# EAGLE design Controller (EAGLE 7.2.0)
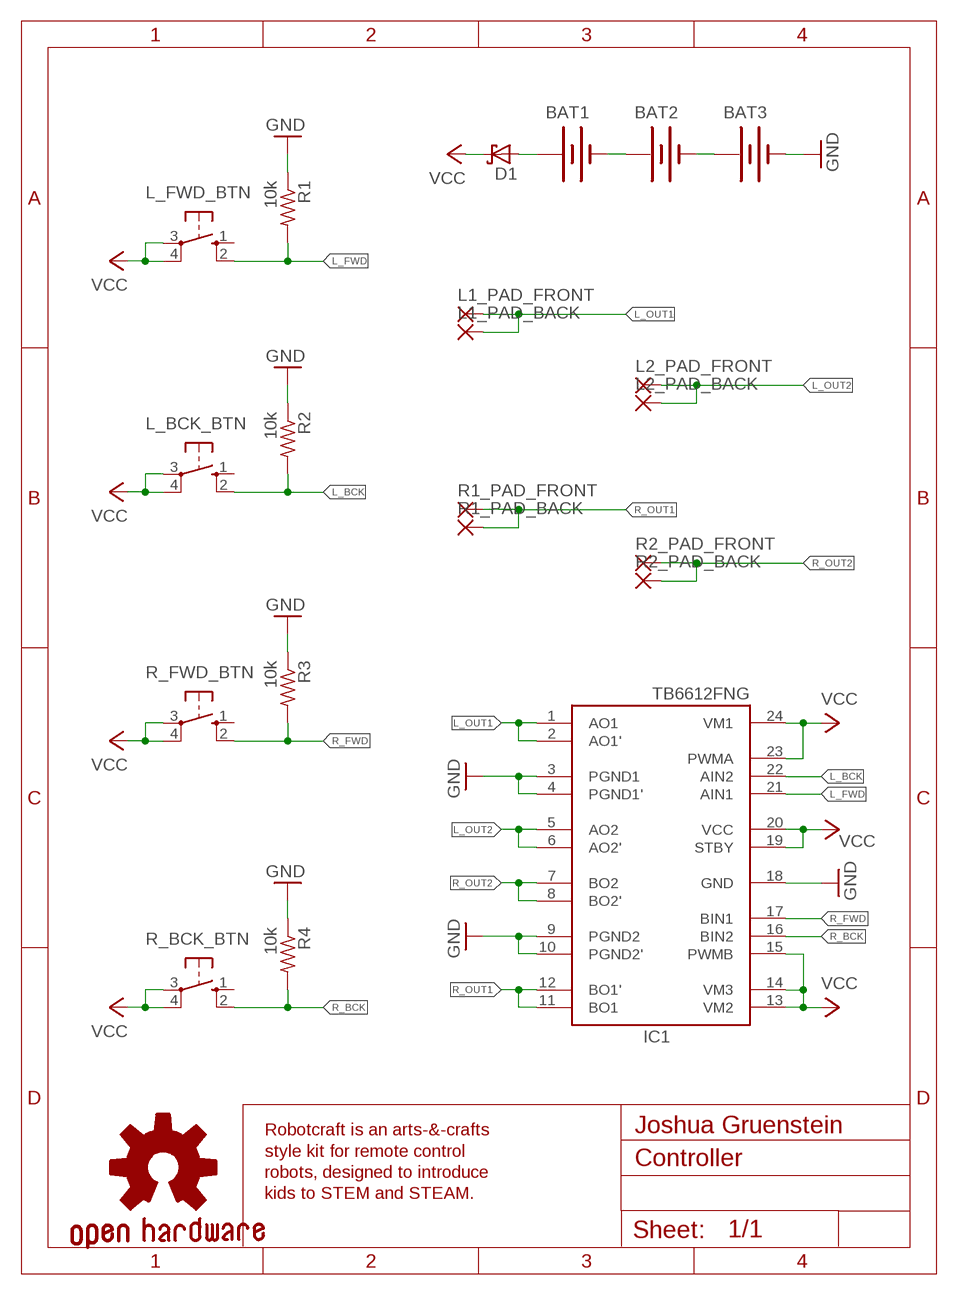
[diagram p0: schematic, sheet 1]

## Parts
BAT1  BATTERYAA-KIT  [BATTERY-AA-KIT]
BAT2  BATTERYAA-KIT  [BATTERY-AA-KIT]
BAT3  BATTERYAA-KIT  [BATTERY-AA-KIT]
D1  SCHOTTKY-DIODESMC  [SMC]
GOLD_ORB_SM1  OSHWLOGO_GOLD_ORB_MED  [OSHW1]
IC1  TB6612FNG  [SSOP24]
L1_PAD_BACK  WIREPADSMD5-2,5  [5-2,5]
L1_PAD_FRONT  WIREPADSMD5-2,5  [5-2,5]
L2_PAD_BACK  WIREPADSMD5-2,5  [5-2,5]
L2_PAD_FRONT  WIREPADSMD5-2,5  [5-2,5]
L_BCK_BTN  40-XX  [B3F-40XX]
L_FWD_BTN  40-XX  [B3F-40XX]
R1  10k  R-US_R0805  [R0805]
R1_PAD_BACK  WIREPADSMD5-2,5  [5-2,5]
R1_PAD_FRONT  WIREPADSMD5-2,5  [5-2,5]
R2  10k  R-US_R0805  [R0805]
R2_PAD_BACK  WIREPADSMD5-2,5  [5-2,5]
R2_PAD_FRONT  WIREPADSMD5-2,5  [5-2,5]
R3  10k  R-US_R0805  [R0805]
R4  10k  R-US_R0805  [R0805]
R_BCK_BTN  40-XX  [B3F-40XX]
R_FWD_BTN  40-XX  [B3F-40XX]

## Nets
GND: BAT3.GND@1(-) IC1.3(PGND1) IC1.4(PGND1') IC1.9(PGND2) IC1.10(PGND2') IC1.18(GND) R1.1 R2.1 R3.1 R4.1
L_BCK: IC1.22(AIN2) L_BCK_BTN.2(S1) R2.2
L_FWD: IC1.21(AIN1) L_FWD_BTN.2(S1) R1.2
L_OUT1: IC1.1(AO1) IC1.2(AO1') L1_PAD_BACK.1(P) L1_PAD_FRONT.1(P)
L_OUT2: IC1.5(AO2) IC1.6(AO2') L2_PAD_BACK.1(P) L2_PAD_FRONT.1(P)
N$1: BAT1.GND@1(-) BAT2.PWR@1(+)
N$2: BAT2.GND@1(-) BAT3.PWR@1(+)
N$3: BAT1.PWR@1(+) D1.A
R_BCK: IC1.16(BIN2) R4.2 R_BCK_BTN.2(S1)
R_FWD: IC1.17(BIN1) R3.2 R_FWD_BTN.2(S1)
R_OUT1: IC1.11(BO1) IC1.12(BO1') R1_PAD_BACK.1(P) R1_PAD_FRONT.1(P)
R_OUT2: IC1.7(BO2) IC1.8(BO2') R2_PAD_BACK.1(P) R2_PAD_FRONT.1(P)
VCC: D1.C IC1.13(VM2) IC1.14(VM3) IC1.15(PWMB) IC1.19(STBY) IC1.20(VCC) IC1.23(PWMA) IC1.24(VM1) L_BCK_BTN.3(P) L_BCK_BTN.4(P1) L_FWD_BTN.3(P) L_FWD_BTN.4(P1) R_BCK_BTN.3(P) R_BCK_BTN.4(P1) R_FWD_BTN.3(P) R_FWD_BTN.4(P1)
Unconnected: L_BCK_BTN.1(S) L_FWD_BTN.1(S) R_BCK_BTN.1(S) R_FWD_BTN.1(S)

## Notes on the sheet
- Joshua Gruenstein
- Robotcraft is an arts-&-crafts
  style kit for remote control
  robots, designed to introduce
  kids to STEM and STEAM.

## Library data of the parts
BAT1-BAT3 = SparkFun-Electromechanical:BATTERY: Battery Holders Various common sizes : AA, AAA, 18650 (PRT-12895), 20mm coin cell and 12mm coin cell. 20MM_4LEGS, BATT-10373; PROD_ID: BATT-08316
D1 = diode:SCHOTTKY-DIODE: Schottky Diode
GOLD_ORB_SM1 = bfl:OSHWLOGO: These are Open-Source Hardware logos.
IC1 = adafruit:TB6612FNG: TB6612FNG MOS dual H-bridge motor driver, 1.2A current 3.2A peak 3 or 5v logic and 3-15v motor
L1_PAD_BACK L1_PAD_FRONT L2_PAD_BACK L2_PAD_FRONT R1_PAD_BACK R1_PAD_FRONT R2_PAD_BACK R2_PAD_FRONT = wirepad:WIREPAD: Wire PAD connect wire on PCB
L_BCK_BTN L_FWD_BTN R_BCK_BTN R_FWD_BTN = switch-omron:40-XX: OMRON SWITCH; MF: OMRON COMPONENTS USA; MPN: B3F-4000; OC_FARNELL: 176434; OC_NEWARK: 36K3105
R1-R4 = rcl:R-US_: RESISTOR, American symbol

## Board
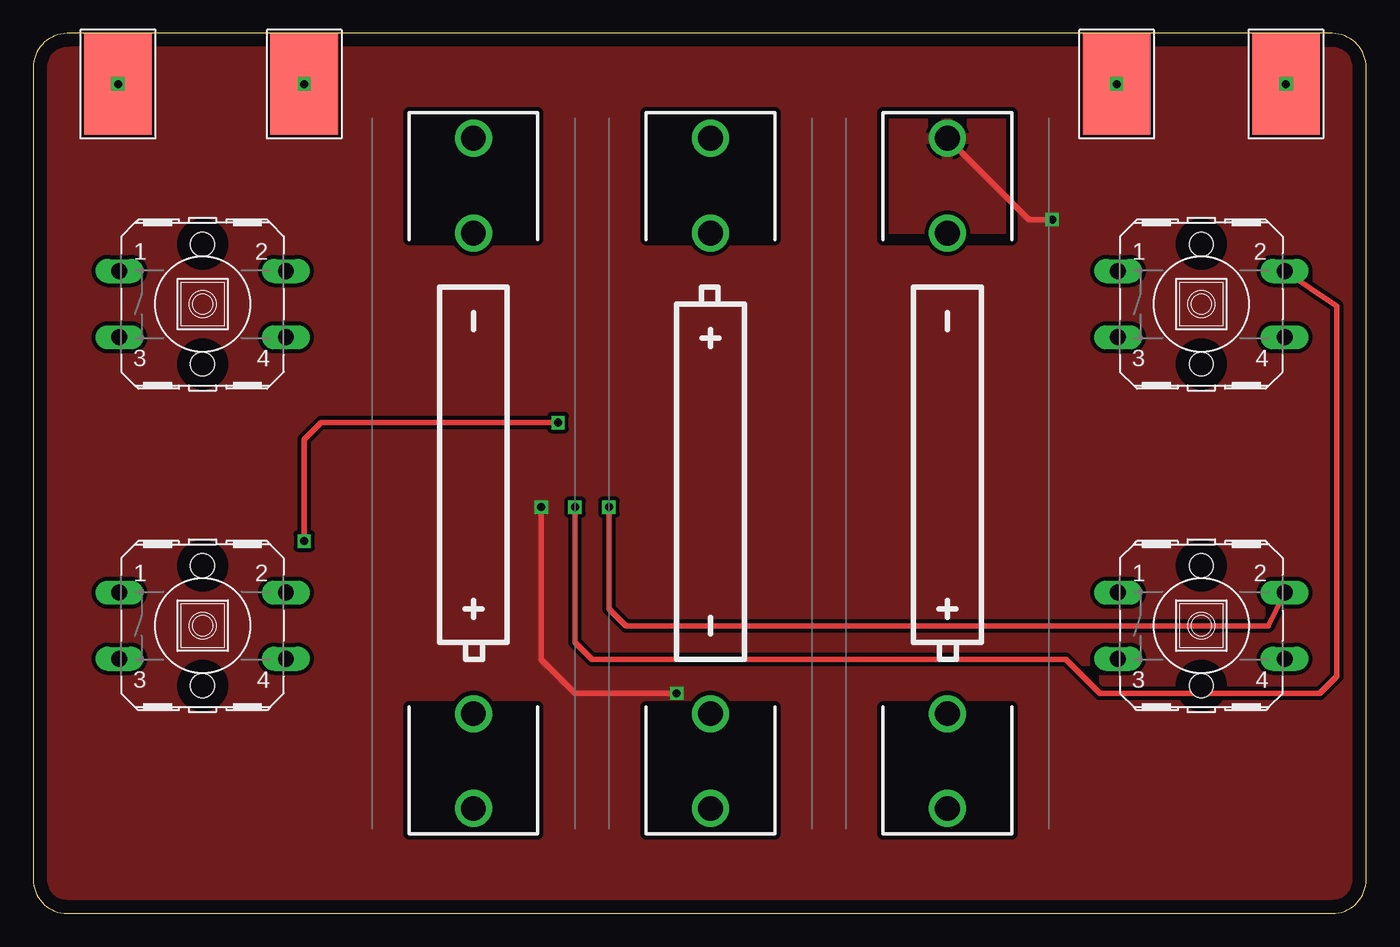
[diagram p1: board, top side]
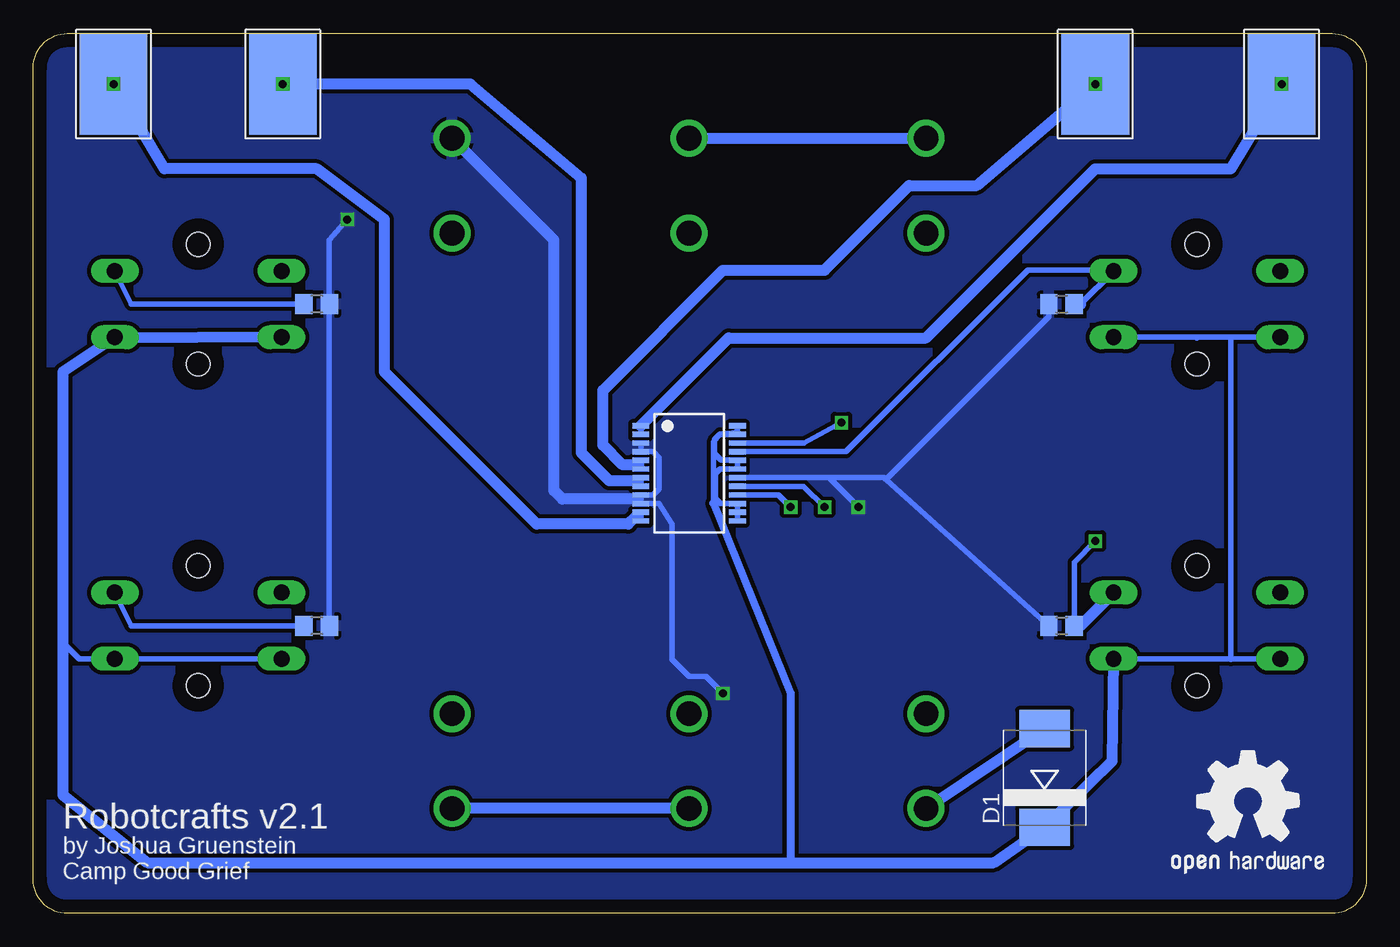
[diagram p2: board, bottom side, seen from below]

Size 100 x 66.03 mm. Coordinates in mm from the lower left corner, seen from the top.
Outline: 0,63.49 0,2.54 arc90 2.54,0 97.46,0 arc90 100,2.54 100,63.49 arc90 97.46,66.03 2.54,66.03 arc90 0,63.49
Copper layers (1*16): Top 0.035mm / dielectric 1.5mm / Bottom 0.035mm
Design rules "default": minimum track width 10mil, minimum drill 24mil, track to track 8mil, track to pad 8mil, pad to pad 8mil, via to via 8mil, smd to smd 8mil, copper to edge 40mil, drill to drill 8mil, minimum pad ring 10mil, minimum via ring 8mil, stop-mask expansion 4mil, vias tented up to drill 0mil, thermal gap 10mil

### Footprints (pad centres in the part's own frame; a part is rotated, then mirrored left to right if it is on the bottom)
BATTERY-AA-KIT = drill 1.854: GND@1 25.146,0; GND@2 18.034,0; PWR@1 -25.146,0; PWR@2 -18.034,0
SMC = smd 2.8 x 3.8: A 3.7,0; C -3.7,0
SSOP24 = smd 0.4 x 1.25: 1 -3.575,-3.625; 2 -2.925,-3.625; 3 -2.275,-3.625; 4 -1.625,-3.625; 5 -0.975,-3.625; 6 -0.325,-3.625; 7 0.325,-3.625; 8 0.975,-3.625; 9 1.625,-3.625; 10 2.275,-3.625; 11 2.925,-3.625; 12 3.575,-3.625; 13 3.575,3.625; 14 2.925,3.625; 15 2.275,3.625; 16 1.625,3.625; 17 0.975,3.625; 18 0.325,3.625; 19 -0.325,3.625; 20 -0.975,3.625; 21 -1.625,3.625; 22 -2.275,3.625; 23 -2.925,3.625; 24 -3.575,3.625
5-2,5 = smd 5.08 x 7.62: 1 1.27,-1.27
B3F-40XX = drill 1.194 long: 1 -6.248,2.489; 2 6.248,2.489; 3 -6.248,-2.489; 4 6.248,-2.489 | hole 1.803: 0,-4.496; 0,4.496
R0805 = smd 1.3 x 1.5: 1 -0.95,0; 2 0.95,0

### Placement (x,y rotation side)
BAT1  33.02,33.02 90 top
BAT2  50.8,33.02 270 top
BAT3  68.58,33.02 90 top
D1  24.13,10.16 90 bottom
GOLD_ORB_SM1  15.24,1.27 0 bottom
IC1  50.8,33.02 270 bottom
L1_PAD_BACK  7.62,63.5 0 bottom
L1_PAD_FRONT  5.08,63.5 0 top
L2_PAD_BACK  21.59,63.5 0 bottom
L2_PAD_FRONT  19.05,63.5 0 top
L_BCK_BTN  12.7,21.59 0 top
L_FWD_BTN  12.7,45.72 0 top
R1  22.86,45.72 0 bottom
R1_PAD_BACK  95.25,63.5 0 bottom
R1_PAD_FRONT  92.71,63.5 0 top
R2  22.86,21.59 0 bottom
R2_PAD_BACK  82.55,63.5 0 bottom
R2_PAD_FRONT  80.01,63.5 0 top
R3  78.74,45.72 180 bottom
R4  78.74,21.59 180 bottom
R_BCK_BTN  87.63,21.59 0 top
R_FWD_BTN  87.63,45.72 0 top

### Tracks (layer width: path | path; a pad name or v marks a point on that pad's centre or on a via)
GND  (via drill 0.6)
  Top 0.406: v38.1,30.48 38.1,19.05 40.64,16.51 v48.26,16.51 | BAT3.GND@1 74.68,52.07 v76.45,52.07
  Bottom 0.406: IC1.3 IC1.4 53.48,34.65 53.04,34.2 53.04,31.86 53.5,31.4 IC1.9 | IC1.9 IC1.10 53.08,30.75 52.07,29.21 52.07,19.05 50.8,17.78 49.53,17.78 v48.26,16.51 | R2.1 36.03,32.55 | 36.03,32.55 36.19,32.7 IC1.18 40.31,32.7 v38.1,30.48 | R1.1 23.81,44.77 36.03,32.55 | R4.1 R3.1 77.79,50.53 v76.45,52.07 | IC1.9 54.62,31.2 54.62,31.05
  Bottom 0.61: 60.96,31.75 60.94,31.73 60.6,31.39
  Bottom 0.813: BAT3.GND@1 60.96,50.55 60.96,31.75 | 54.62,31.05 54.66,31.09 60.3,31.09 60.94,31.73
  pour Top (isolate 0.305): -1.27,67.31 101.6,67.31 101.6,-1.27 -1.27,-1.27
  pour Bottom (isolate 0.305): 0,67.31 101.6,67.31 101.6,-1.27 -1.27,-1.27 -1.27,67.31
L_BCK  (via drill 0.6)
  Top 0.406: v20.32,27.94 20.32,35.56 21.59,36.83 v39.37,36.83
  Bottom 0.406: R2.2 21.91,26.35 v20.32,27.94 | v39.37,36.83 42.17,35.3 IC1.22
  Bottom 0.813: R2.2 21.44,21.59 L_BCK_BTN.2
L_FWD
  Bottom 0.406: IC1.21 39.02,34.65 25.4,48.26 19,48.26 L_FWD_BTN.2 21.44,45.72
  Bottom 0.813: 21.44,45.72 R1.2
L_OUT1  (via drill 0.6)
  Bottom 0.406: IC1.2 IC1.1
  Bottom 0.813: IC1.1 47.84,43.18 33.02,43.18 20.32,55.88 10.16,55.88 L1_PAD_BACK.1
  other vias: 6.35,62.23
L_OUT2  (via drill 0.6)
  Bottom 0.406: IC1.6 IC1.5 54.42,33.81 54.57,33.66
  Bottom 0.813: 54.57,33.66 55.79,33.66 57.27,35.14 57.27,39.25 48.26,48.26 40.64,48.26 34.29,54.61 29.21,54.61 L2_PAD_BACK.1
  other vias: 20.32,62.23
N$1
  Bottom 0.813: BAT2.PWR@1 BAT1.GND@1
N$2
  Bottom 0.813: BAT2.GND@1 BAT3.PWR@1
N$3
  Bottom 0.813: BAT1.PWR@1 D1.A
R_BCK  (via drill 0.6)
  Top 0.406: v43.18,30.48 43.18,22.86 44.45,21.59 92.66,21.59 R_BCK_BTN.2
  Bottom 0.406: IC1.16 44.09,31.39 v43.18,30.48 | R4.2 92.66,21.59 R_BCK_BTN.2
R_FWD  (via drill 0.6)
  Top 0.406: v40.64,30.48 40.64,20.32 41.91,19.05 77.47,19.05 80.01,16.51 96.52,16.51 97.79,17.78 97.79,45.57 R_FWD_BTN.2
  Bottom 0.406: IC1.17 42.2,32.05 v40.64,30.48 | R_FWD_BTN.2 92.66,45.72 R3.2
R_OUT1  (via drill 0.6)
  Bottom 0.406: IC1.12 IC1.11 54.76,29.76 54.81,29.76
  Bottom 0.813: 54.81,29.76 55.36,29.21 62.23,29.21 73.66,40.64 73.66,52.07 78.74,55.88 90.17,55.88 R1_PAD_FRONT.1
  other vias: 93.98,62.23
R_OUT2  (via drill 0.6)
  Bottom 0.406: IC1.8 IC1.7 54.73,32.38 54.86,32.38
  Bottom 0.813: 54.86,32.38 54.94,32.46 56.78,32.46 58.88,34.56 58.88,55.18 67.2,62.23 R2_PAD_FRONT.1
  other vias: 81.28,62.23
VCC
  Bottom 0.406: IC1.13 IC1.14 IC1.15 48.45,30.75 48.83,31.12 48.83,33.02 48.49,33.34 IC1.19 IC1.20 47.18,34 48.41,34 48.9,34.49 48.9,35.56 48.51,35.95 IC1.23 IC1.24 47.19,36.08 48.49,35.98 48.97,35.38 48.97,30.76 | 10.16,43.23 L_FWD_BTN.4 12.75,43.23 12.7,43.18 | 10.16,43.23 L_FWD_BTN.3 | L_BCK_BTN.4 10.21,19.1 | 10.21,19.1 L_BCK_BTN.3 | 10.21,19.1 10.16,19.05 10.16,43.23 | R_FWD_BTN.3 R_FWD_BTN.4 97.79,40.59 97.79,20.32 96.57,19.1 R_BCK_BTN.4 R_BCK_BTN.3
  Bottom 0.61: 48.97,30.76 43.18,16.51 43.18,3.81
  Bottom 0.813: L_BCK_BTN.4 19.05,11.43 D1.C 27.94,3.81 43.18,3.81 91.44,3.81 97.79,8.89 97.79,40.64 93.98,43.18 R_FWD_BTN.3

### Text on the board
bNames: Robotcrafts v2.1 | by Joshua Gruenstein / Camp Good Grief